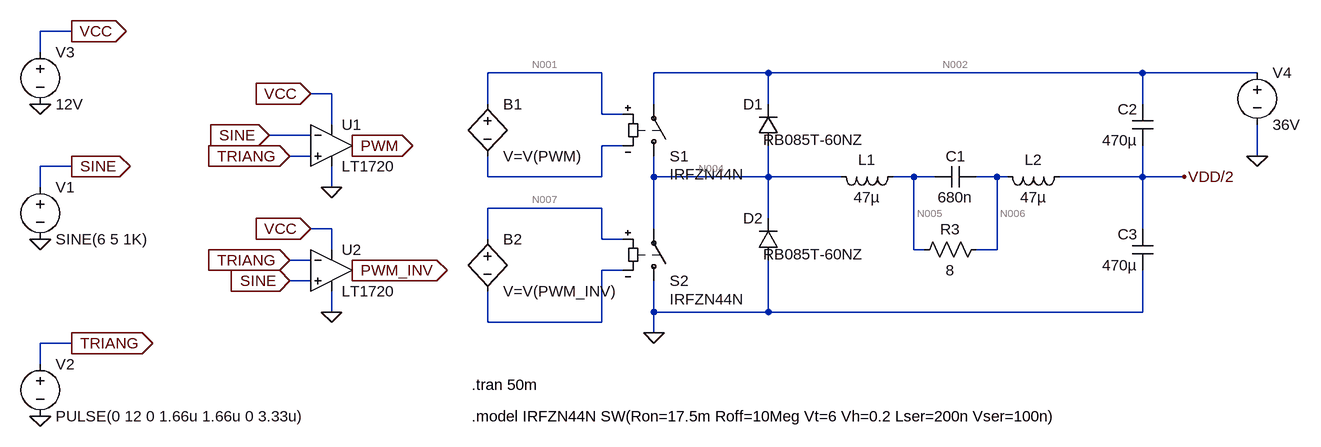
[diagram p0: schematic Draft1.asc]
Draft1.asc, the LTspice schematic file:
Version 4
SHEET 1 1608 708
WIRE -496 96 -544 96
WIRE -544 128 -544 96
WIRE 320 160 144 160
WIRE 576 160 400 160
WIRE 1152 160 576 160
WIRE 1328 160 1152 160
WIRE -96 192 -128 192
WIRE 144 208 144 160
WIRE 400 208 400 160
WIRE 576 208 576 160
WIRE 1152 208 1152 160
WIRE 320 224 320 160
WIRE 352 224 320 224
WIRE -96 240 -96 192
WIRE -128 256 -192 256
WIRE 352 272 320 272
WIRE -128 288 -160 288
WIRE 1328 288 1328 240
WIRE -496 304 -544 304
WIRE 144 320 144 288
WIRE 320 320 320 272
WIRE 320 320 144 320
WIRE 400 320 400 288
WIRE 576 320 576 272
WIRE 576 320 400 320
WIRE 688 320 576 320
WIRE 800 320 768 320
WIRE 832 320 800 320
WIRE 928 320 896 320
WIRE 944 320 928 320
WIRE 1152 320 1152 272
WIRE 1152 320 1024 320
WIRE 1216 320 1152 320
WIRE -544 336 -544 304
WIRE -96 336 -96 304
WIRE 320 368 144 368
WIRE 576 384 576 320
WIRE -96 400 -128 400
WIRE 400 400 400 320
WIRE 1152 400 1152 320
WIRE 144 416 144 368
WIRE 320 416 320 368
WIRE 352 416 320 416
WIRE -96 432 -96 400
WIRE 800 432 800 320
WIRE 816 432 800 432
WIRE 928 432 928 320
WIRE 928 432 896 432
WIRE -128 448 -160 448
WIRE 352 464 320 464
WIRE -128 480 -160 480
WIRE -96 528 -96 496
WIRE 400 528 400 480
WIRE 576 528 576 448
WIRE 576 528 400 528
WIRE 1152 528 1152 464
WIRE 1152 528 576 528
WIRE 144 544 144 496
WIRE 320 544 320 464
WIRE 320 544 144 544
WIRE 400 560 400 528
WIRE -496 576 -544 576
WIRE -544 608 -544 576
FLAG -496 96 VCC
IOPIN -496 96 Out
FLAG -544 208 0
FLAG -496 304 SINE
IOPIN -496 304 Out
FLAG -544 416 0
FLAG -496 576 TRIANG
IOPIN -496 576 Out
FLAG -544 688 0
FLAG -128 192 VCC
IOPIN -128 192 In
FLAG -192 256 SINE
IOPIN -192 256 In
FLAG -160 288 TRIANG
IOPIN -160 288 In
FLAG -96 336 0
FLAG -128 400 VCC
IOPIN -128 400 In
FLAG -160 448 TRIANG
IOPIN -160 448 In
FLAG -160 480 SINE
IOPIN -160 480 In
FLAG -96 528 0
FLAG -64 464 PWM_INV
IOPIN -64 464 Out
FLAG -64 272 PWM
IOPIN -64 272 Out
FLAG 1216 320 VDD/2
FLAG 1328 288 0
FLAG 400 560 0
SYMBOL Comparators/LT1720 -96 208 R0
SYMATTR InstName U1
SYMBOL Comparators/LT1720 -96 400 R0
SYMATTR InstName U2
SYMBOL Voltage -544 112 R0
SYMATTR InstName V3
SYMATTR Value 12V
SYMBOL Voltage -544 320 R0
SYMATTR InstName V1
SYMATTR Value SINE(6 5 1K)
SYMBOL Voltage -544 592 R0
WINDOW 123 0 0 Left 0
WINDOW 39 0 0 Left 0
SYMATTR InstName V2
SYMATTR Value PULSE(0 12 0 1.66u 1.66u 0 3.33u)
SYMBOL sw 400 304 M180
WINDOW 3 24 -12 Left 2
SYMATTR Value IRFZN44N
SYMATTR InstName S1
SYMBOL sw 400 496 M180
WINDOW 3 24 -12 Left 2
SYMATTR Value IRFZN44N
SYMATTR InstName S2
SYMBOL diode 592 272 R180
WINDOW 0 24 64 Left 2
WINDOW 3 -132 9 Left 2
SYMATTR InstName D1
SYMATTR Value RB085T-60NZ
SYMBOL diode 592 448 R180
WINDOW 0 24 64 Left 2
WINDOW 3 -132 9 Left 2
SYMATTR InstName D2
SYMATTR Value RB085T-60NZ
SYMBOL ind 784 304 R90
WINDOW 0 5 56 VBottom 2
WINDOW 3 32 56 VTop 2
SYMATTR InstName L1
SYMATTR Value 47µ
SYMATTR SpiceLine Rser=1m
SYMBOL ind 1040 304 R90
WINDOW 0 5 56 VBottom 2
WINDOW 3 32 56 VTop 2
SYMATTR InstName L2
SYMATTR Value 47µ
SYMATTR SpiceLine Rser=1m
SYMBOL cap 896 304 R90
WINDOW 0 0 32 VBottom 2
WINDOW 3 32 32 VTop 2
SYMATTR InstName C1
SYMATTR Value 680n
SYMBOL cap 1168 272 R180
WINDOW 0 24 56 Left 2
WINDOW 3 24 8 Left 2
SYMATTR InstName C2
SYMATTR Value 470µ
SYMBOL cap 1168 464 R180
WINDOW 0 24 56 Left 2
WINDOW 3 24 8 Left 2
SYMATTR InstName C3
SYMATTR Value 470µ
SYMBOL voltage 1328 144 R0
SYMATTR InstName V4
SYMATTR Value 36V
SYMBOL res 912 416 R90
WINDOW 0 0 56 VBottom 2
WINDOW 3 32 56 VTop 2
SYMATTR InstName R3
SYMATTR Value 8
SYMBOL bv 144 192 R0
SYMATTR InstName B1
SYMATTR Value V=V(PWM)
SYMBOL bv 144 400 R0
SYMATTR InstName B2
SYMATTR Value V=V(PWM_INV)
TEXT 120 640 Left 2 !.tran 50m
TEXT 120 688 Left 2 !.model IRFZN44N SW(Ron=17.5m Roff=10Meg Vt=6 Vh=0.2 Lser=200n Vser=100n)

The netlist it stands for:
* Draft1.asc
XU1 TRIANG SINE VCC 0 PWM LT1720  ; pins In+ In- V+ V- OUT
XU2 SINE TRIANG VCC 0 PWM_INV LT1720  ; pins In+ In- V+ V- OUT
V3 VCC 0 12V
V1 SINE 0 SINE(6 5 1K)
V2 TRIANG 0 PULSE(0 12 0 1.66u 1.66u 0 3.33u)
S1 N004 N002 N001 N003 IRFZN44N
S2 0 N004 N007 N008 IRFZN44N
D1 N004 N002 RB085T-60NZ
D2 0 N004 RB085T-60NZ
L1 N005 N004 47µ Rser=1m
L2 VDD/2 N006 47µ Rser=1m
C1 N006 N005 680n
C2 VDD/2 N002 470µ
C3 0 VDD/2 470µ
V4 N002 0 36V
R3 N006 N005 8
B1 N001 N003 V=V(PWM)
B2 N007 N008 V=V(PWM_INV)
.model D D
.lib standard.dio
.tran 50m
.model IRFZN44N SW(Ron=17.5m Roff=10Meg Vt=6 Vh=0.2 Lser=200n Vser=100n)
.lib LT1720.sub
.backanno
.end

* Results of the author's LTspice run, read from the files saved beside the schematic
* Operating Point, zero values left out:
*   V(n001) = 172.7 mV
*   V(n002) = 36 V
*   V(n004) = 311.4 nV
*   V(n005) = 311.4 nV
*   V(n006) = 311.4 nV
*   V(n007) = 11.82 V
*   V(pwm) = 172.7 mV
*   V(pwm_inv) = 11.82 V
*   V(sine) = 6 V
*   V(vcc) = 12 V
*   V(vdd/2) = 311.4 nV
*   I(D1) = -14.2 µA
*   I(D2) = -20.9 pA
*   I(S1) = 3.6 µA
*   I(S2) = 17.8 µA
*   I(V1) = 200 pA
*   I(V2) = 10 µA
*   I(V3) = -15.02 mA
*   I(V4) = -17.8 µA
*   Ix(u1:1) = -5 µA
*   Ix(u1:2) = -100 pA
*   Ix(u1:3) = 7.507 mA
*   Ix(u1:4) = -7.502 mA
*   Ix(u1:5) = 11.64 pA
*   Ix(u2:1) = -100 pA
*   Ix(u2:2) = -5 µA
*   Ix(u2:3) = 7.508 mA
*   Ix(u2:4) = -7.503 mA
*   Ix(u2:5) = -11.65 pA